# Altium schematic sheet QUTMS-TSAL-S04.SchDoc: Zener Voltage Regulator
size A3; DrawnBy: Joseph Richards; DocumentNumber: 5; Revision: 2; SheetNumber: 5; SheetTotal: 5
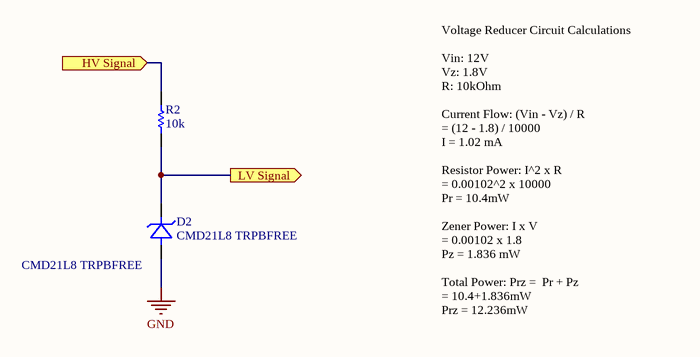
[diagram p0: QUTMS-TSAL-S04.SchDoc]

## Parts
D2  CMD21L8 TRPBFREE  [SODFL160X80-2N]
R2  10k  [Res_ThinFilm_0603]

## Ports
HV Signal (in), LV Signal (out)

## Nets
GND: D2.A(Anode)
HV Signal: R2.2 ; port HV Signal
LV Signal: D2.K(Cathode) R2.1 ; port LV Signal

## Notes on the sheet
- (near D2) CMD21L8 TRPBFREE
- Voltage Reducer Circuit Calculations
  Vin: 12V
  Vz: 1.8V
  R: 10kOhm
  Current Flow: (Vin - Vz) / R
  = (12 - 1.8) / 10000
  I = 1.02 mA
  Resistor Power: I^2 x R
  = 0.00102^2 x 10000
  Pr = 10.4mW
  Zener Power: I x V
  = 0.00102 x 1.8
  Pz = 1.836 mW
  Total Power: Prz =  Pr + Pz
  = 10.4+1.836mW
  Prz = 12.236mW
- Revision History:
- Sheet Title:
- Rev
- Date
- Description
- Project:
- Size:
- Drawn By:
- A3
- Number:
- Revision:
- Sheet
- Version:
- of
- QUT Motorsport
- O-120, Gardens Point
- 2 George Street
- Brisbane, QLD 4000
- Australia
- Print Date:
- Print Time:
- File Name:

## Library data of the parts
R2 = 10k 5% 0603: Resistor, SMD, 10k, 0.1W, 5%, 0603